# EAGLE schematic PMM_R_19 (EAGLE 7.2.0)
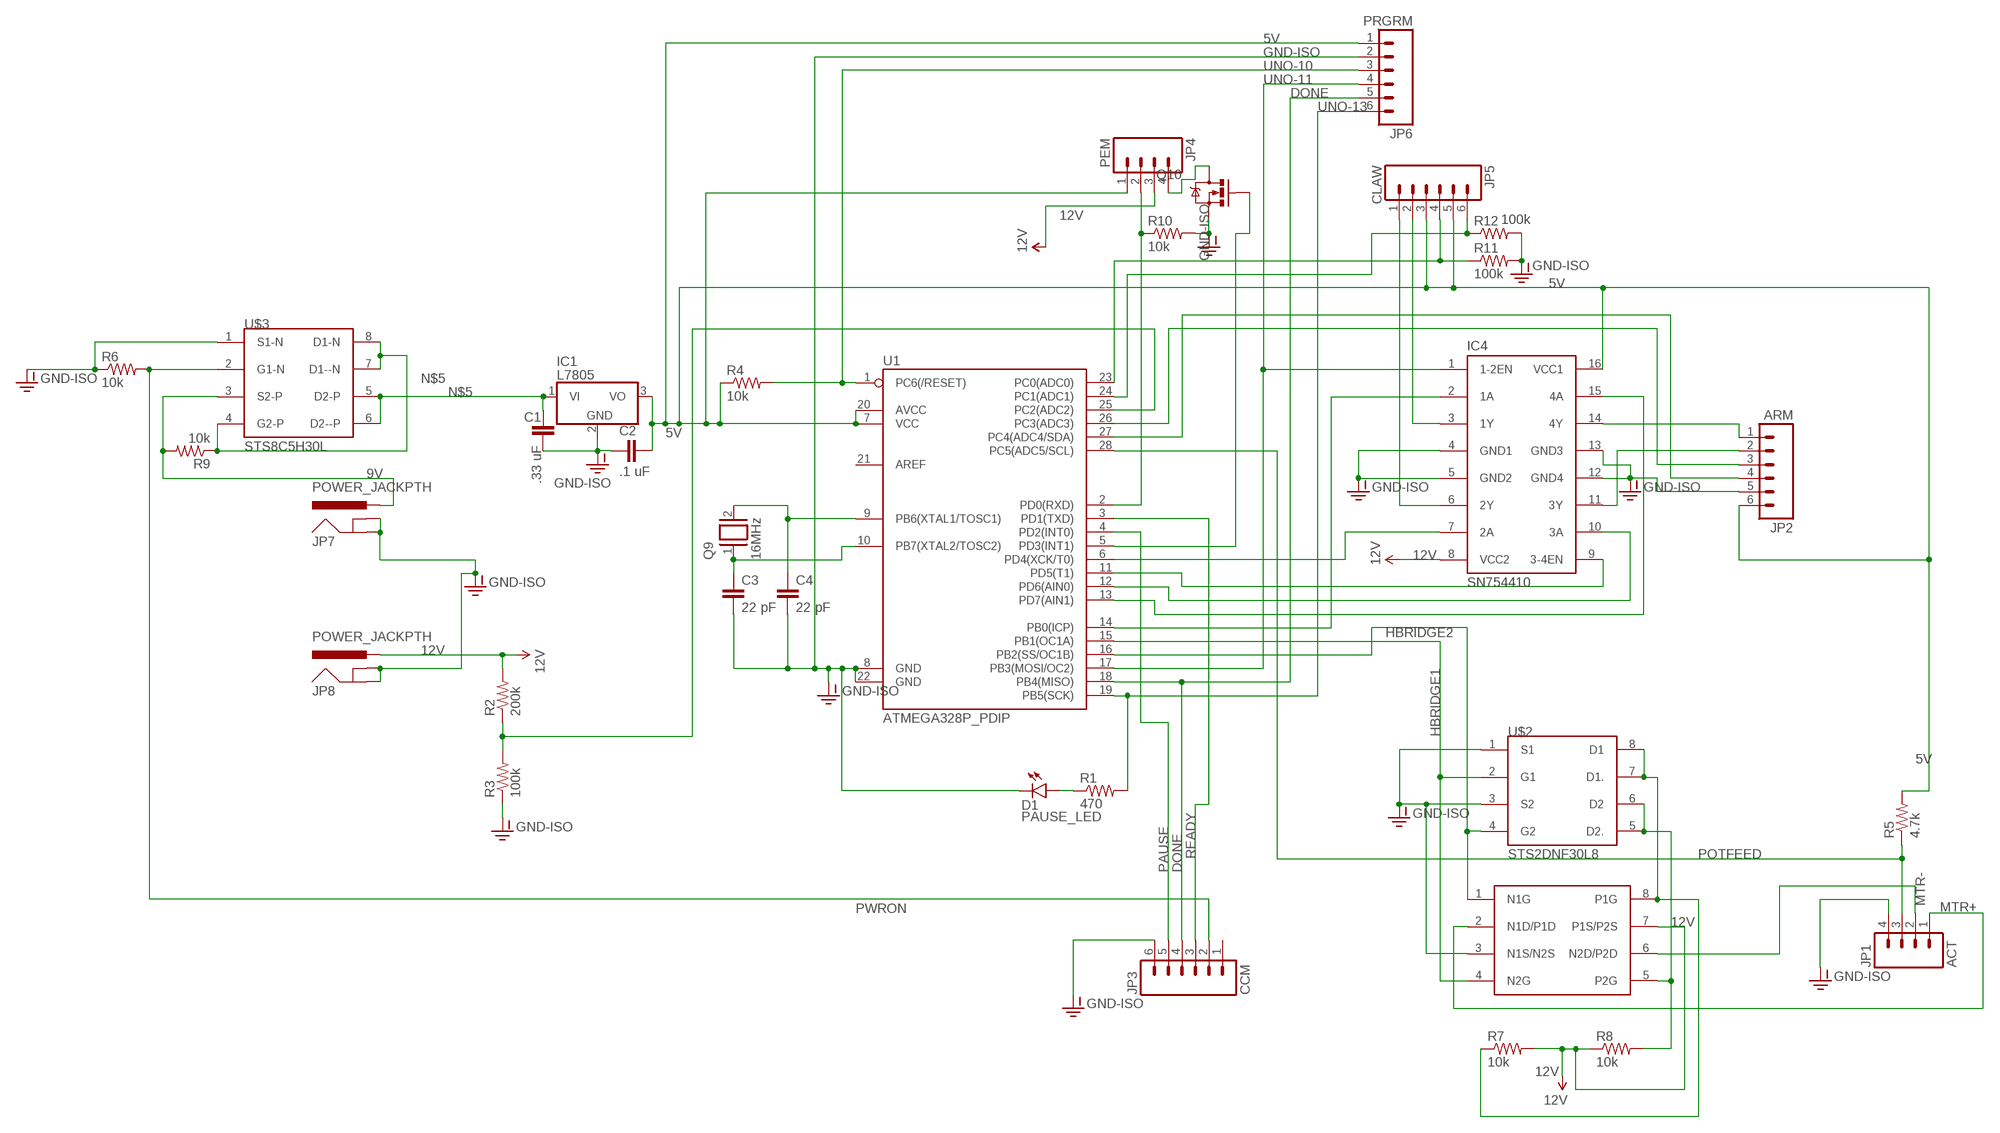
[diagram p0: schematic, sheet 1]

## Parts
C1  .33 uF  CAPKIT  [CAP-PTH-SMALL-KIT]
C2  .1 uF  CAPKIT  [CAP-PTH-SMALL-KIT]
C3  22 pF  C2,5-3  [C2.5-3]
C4  22 pF  C2,5-3  [C2.5-3]
D1  PAUSE_LED  LED5MM  [LED5MM]
DMHC3025LSD8  DMHC3025LSD8  [SOIC-8]
IC1  L7805  7818TV  [TO220V]
IC4  SN754410  L293D  [DIL16]
JP1  ACT  M04PTH  [1X04]
JP2  ARM  M06SILK_FEMALE_PTH  [1X06]
JP3  CCM  M06SILK_FEMALE_PTH  [1X06]
JP4  PEM  M04PTH  [1X04]
JP5  CLAW  M06SILK_FEMALE_PTH  [1X06]
JP6  PRGRM  M06SILK_FEMALE_PTH  [1X06]
JP7  POWER_JACKPTH  [POWER_JACK_PTH]
JP8  POWER_JACKPTH  [POWER_JACK_PTH]
Q9  16MHz  XTAL/S  [QS]
Q10  MOSFET-NCHANNELFQP30N06L  [TO220V]
R1  470  RESISTOR1206  [1206]
R2  200k  RESISTOR1206  [1206]
R3  100k  RESISTOR1206  [1206]
R4  10k  RESISTOR1206  [1206]
R5  4.7k  RESISTOR1206  [1206]
R6  10k  RESISTOR1206  [1206]
R7  10k  RESISTOR1206  [1206]
R8  10k  RESISTOR1206  [1206]
R9  10k  RESISTOR1206  [1206]
R10  10k  RESISTOR1206  [1206]
R11  100k  RESISTOR1206  [1206]
R12  100k  RESISTOR1206  [1206]
U1  ATMEGA328P_PDIP  [DIL28-3]
U$2  STS2DNF30L8  [SOIC-8]
U$3  STS8C5H30L  STS8C5H30LSTS8C5H30L  [SOIC-8]

## Nets
5V [supply]: C2.1 IC1.3(VO) IC4.16(VCC1) JP2.6 JP4.1 JP5.3 JP5.5 JP6.1 R4.1 R5.2 U1.7(VCC) U1.20(AVCC)
9V [supply]: JP7.PWR R9.2 U$3.3(S2-P)
12V [actuator]: DMHC3025LSD8.7(P1S/P2S) IC4.8(VCC2) JP4.3 JP8.PWR R2.2 R7.2 R8.1
DONE: JP3.4 JP6.5 U1.18(PB4(MISO))
GND-ISO [actuator]: C1.2 C2.2 C3.2 C4.2 D1.K(C) DMHC3025LSD8.3(N1S/N2S) IC1.2(GND) IC4.4(GND1) IC4.5(GND2) IC4.12(GND4) IC4.13(GND3) JP1.4 JP2.5 JP3.6 JP6.2 JP7.GND JP7.GNDBREAK JP8.GND JP8.GNDBREAK Q10.3(S) R3.1 R6.1 R10.2 R11.2 R12.2 U1.8(GND) U1.22(GND) U$2.1(S1) U$2.3(S2) U$3.1(S1-N)
HBRIDGE1: DMHC3025LSD8.4(N2G) U1.15(PB1(OC1A)) U$2.2(G1)
HBRIDGE2: DMHC3025LSD8.1(N1G) U1.16(PB2(SS/OC1B)) U$2.4(G2)
MTR+ [actuator]: DMHC3025LSD8.2(N1D/P1D) JP1.1
MTR- [actuator]: DMHC3025LSD8.6(N2D/P2D) JP1.2
N$2: D1.A R1.1
N$3: R2.1 R3.2 U1.25(PC2(ADC2))
N$4 [motor]: IC4.11(3Y) JP2.2
N$5 [supply]: C1.1 IC1.1(VI) U$3.5(D2-P) U$3.6(D2--P)
N$6: R9.1 U$3.4(G2-P) U$3.7(D1--N) U$3.8(D1-N)
N$7 [motor]: IC4.6(2Y) JP5.1
N$8: DMHC3025LSD8.8(P1G) R7.1 U$2.7(D1.) U$2.8(D1)
N$9: JP4.4 Q10.2(D)
N$10 [motor]: IC4.3(1Y) JP5.2
N$11: C3.1 Q9.1 U1.10(PB7(XTAL2/TOSC2))
N$12: IC4.2(1A) U1.14(PB0(ICP))
N$13: IC4.7(2A) U1.6(PD4(XCK/T0))
N$14: JP5.4 R11.1 U1.23(PC0(ADC0))
N$15: JP5.6 R12.1 U1.24(PC1(ADC1))
N$16 [motor]: IC4.14(4Y) JP2.1
N$17: JP2.3 U1.26(PC3(ADC3))
N$18: JP4.2 R10.1 U1.2(PD0(RXD))
N$19: JP2.4 U1.27(PC4(ADC4/SDA))
N$20: C4.1 Q9.2 U1.9(PB6(XTAL1/TOSC1))
N$21: IC4.9(3-4EN) U1.11(PD5(T1))
N$22: IC4.10(3A) U1.12(PD6(AIN0))
N$23: IC4.15(4A) U1.13(PD7(AIN1))
N$25: DMHC3025LSD8.5(P2G) R8.2 U$2.5(D2.) U$2.6(D2)
N$26: Q10.1(G) U1.5(PD3(INT1))
PAUSE: JP3.5 U1.4(PD2(INT0))
POTFEED: JP1.3 R5.1 U1.28(PC5(ADC5/SCL))
PWRON: JP3.2 R6.2 U$3.2(G1-N)
READY: JP3.3 U1.3(PD1(TXD))
UNO-10: JP6.3 R4.2 U1.1(PC6(/RESET))
UNO-11: IC4.1(1-2EN) JP6.4 U1.17(PB3(MOSI/OC2))
UNO-13: JP6.6 R1.2 U1.19(PB5(SCK))
Unconnected: JP3.1 U1.21(AREF)

## Library data of the parts
C1 C2 = SparkFun-Capacitors:CAP: Capacitor Standard 0603 ceramic capacitor, and 0.1" leaded capacitor.
C3 C4 = capacitor-wima:C: CAPACITOR naming: grid - package width
D1 = SparkFun-LED:LED: LEDs Standard schematic elements and footprints for 5mm, 3mm, 1206, and 0603 sized LEDs. 5mm - Spark Fun Electronics SKU : COM-00529 (and others)
DMHC3025LSD8 = Custom:DMHC3025LSD
IC1 = linear:78*: Positive VOLTAGE REGULATOR Source: http://cache.national.com/ds/LM/LM78L05.pdf http://www.fairchildsemi.com/ds/LM/LM7805.pdf
IC4 = st-microelectronics:L293D: PUSH-PULL 4 CHANNEL DRIVER; MPN: L293D; OC_FARNELL: 9589619; OC_NEWARK: 56P8249
JP1 JP4 = SparkFun-Connectors:M04: Header 4 Standard 4-pin 0.1" header. Use with straight break away headers (SKU : PRT-00116), right angle break away headers (PRT-00553), swiss pins (PRT-00743), machine pins (PRT-00117), and female headers (PRT-00115). Molex polarized connector foot print use with SKU : PRT-08231 with associated crimp pins and housings. 1MM SMD Version SKU: PRT-10208
JP2 JP3 JP5 JP6 = SparkFun-Connectors:M06: Header 6 Standard 6-pin 0.1" header. Use with straight break away headers (SKU : PRT-00116), right angle break away headers (PRT-00553), swiss pins (PRT-00743), machine pins (PRT-00117), and female headers (PRT-00115). Molex polarized connector foot print use with SKU : PRT-08094 with associated crimp pins and housings. NOTES ON THE VARIANTS LOCK and LOCK_LONGPADS... This footprint was designed to help hold the alignment of a through-hole component (i.e. 6-pin header) while soldering it into place. You may notice that each hole has been shifted either up or down by 0.005 of an inch from it's more standard position (which is a perfectly straight line). This slight alteration caused the pins (the squares in the middle) to touch the edges of the holes. Because they are alternating, it causes a "brace" to hold the component in place. 0.005 has proven to be the perfect amount of "off-center" position when using our standard breakaway headers. Although looks a little odd when you look at the bare footprint, once you have a header in there, the alteration is very hard to notice. Also,if you push a header all the way into place, it is covered up entirely on the bottom side. This idea of altering the position of holes to aid alignment will be further integrated into the Sparkfun Library for other footprints. It can help hold any component with 3 or more connection pins.; PROD_ID: CONN-08437
JP7 JP8 = SparkFun-Connectors:POWER_JACK: Power Jack This is the standard 5.5mm barrel jack for power. The PTH is the most common, proven, reliable, footprint. The Slot footprint only works if the mill layer is transmitted to the PCB fab house so be warned. Mating wall wart : TOL-00298 (and others); PROD_ID: CONN-08197
Q9 = special:XTAL/S: CRYSTAL
Q10 = SparkFun-DiscreteSemi:MOSFET-NCHANNEL: Common NMOSFET Parts MFG P/N Store ID Prod ID FDD8780 TRANS-09984 SI7820DN TRANS-11055 FDS6630A IC-08089 2N7002PW TRANS-11151 FQP30N06L COM-10213 TRANS-10060 BSS123LT1G TRANS-08345 BSS138 TRANS-00830 BS170 2N7000; PROD_ID: TRANS-10060
R1-R12 = SparkFun-Passives:RESISTOR: Resistor Basic schematic elements and footprints for 0603, 1206, and PTH resistors.
U1 = SparkFun-DigitalIC:ATMEGA328P_PDIP: uC used in the Arduino 32kb flash, 1k EEPROM, 2k SRAM This is the through-hole version of this chip.
U$2 = Custom:STS2DNF30L
U$3 = Custom:STS8C5H30L

## Net classes
1 actuator: width 0.813 mm, clearance 0.229 mm
2 motor: width 0.406 mm, clearance 0.229 mm
3 supply: width 0.406 mm, clearance 0.229 mm